# EasyEDA schematic SD_Card.json

## Sheets
1 ESP32: TITLE: Sheet_1; REV: 1.0; Date: 2026-05-02; Sheet: 1/1; Drawn By: levonnkarapetyan; Company: Your Company
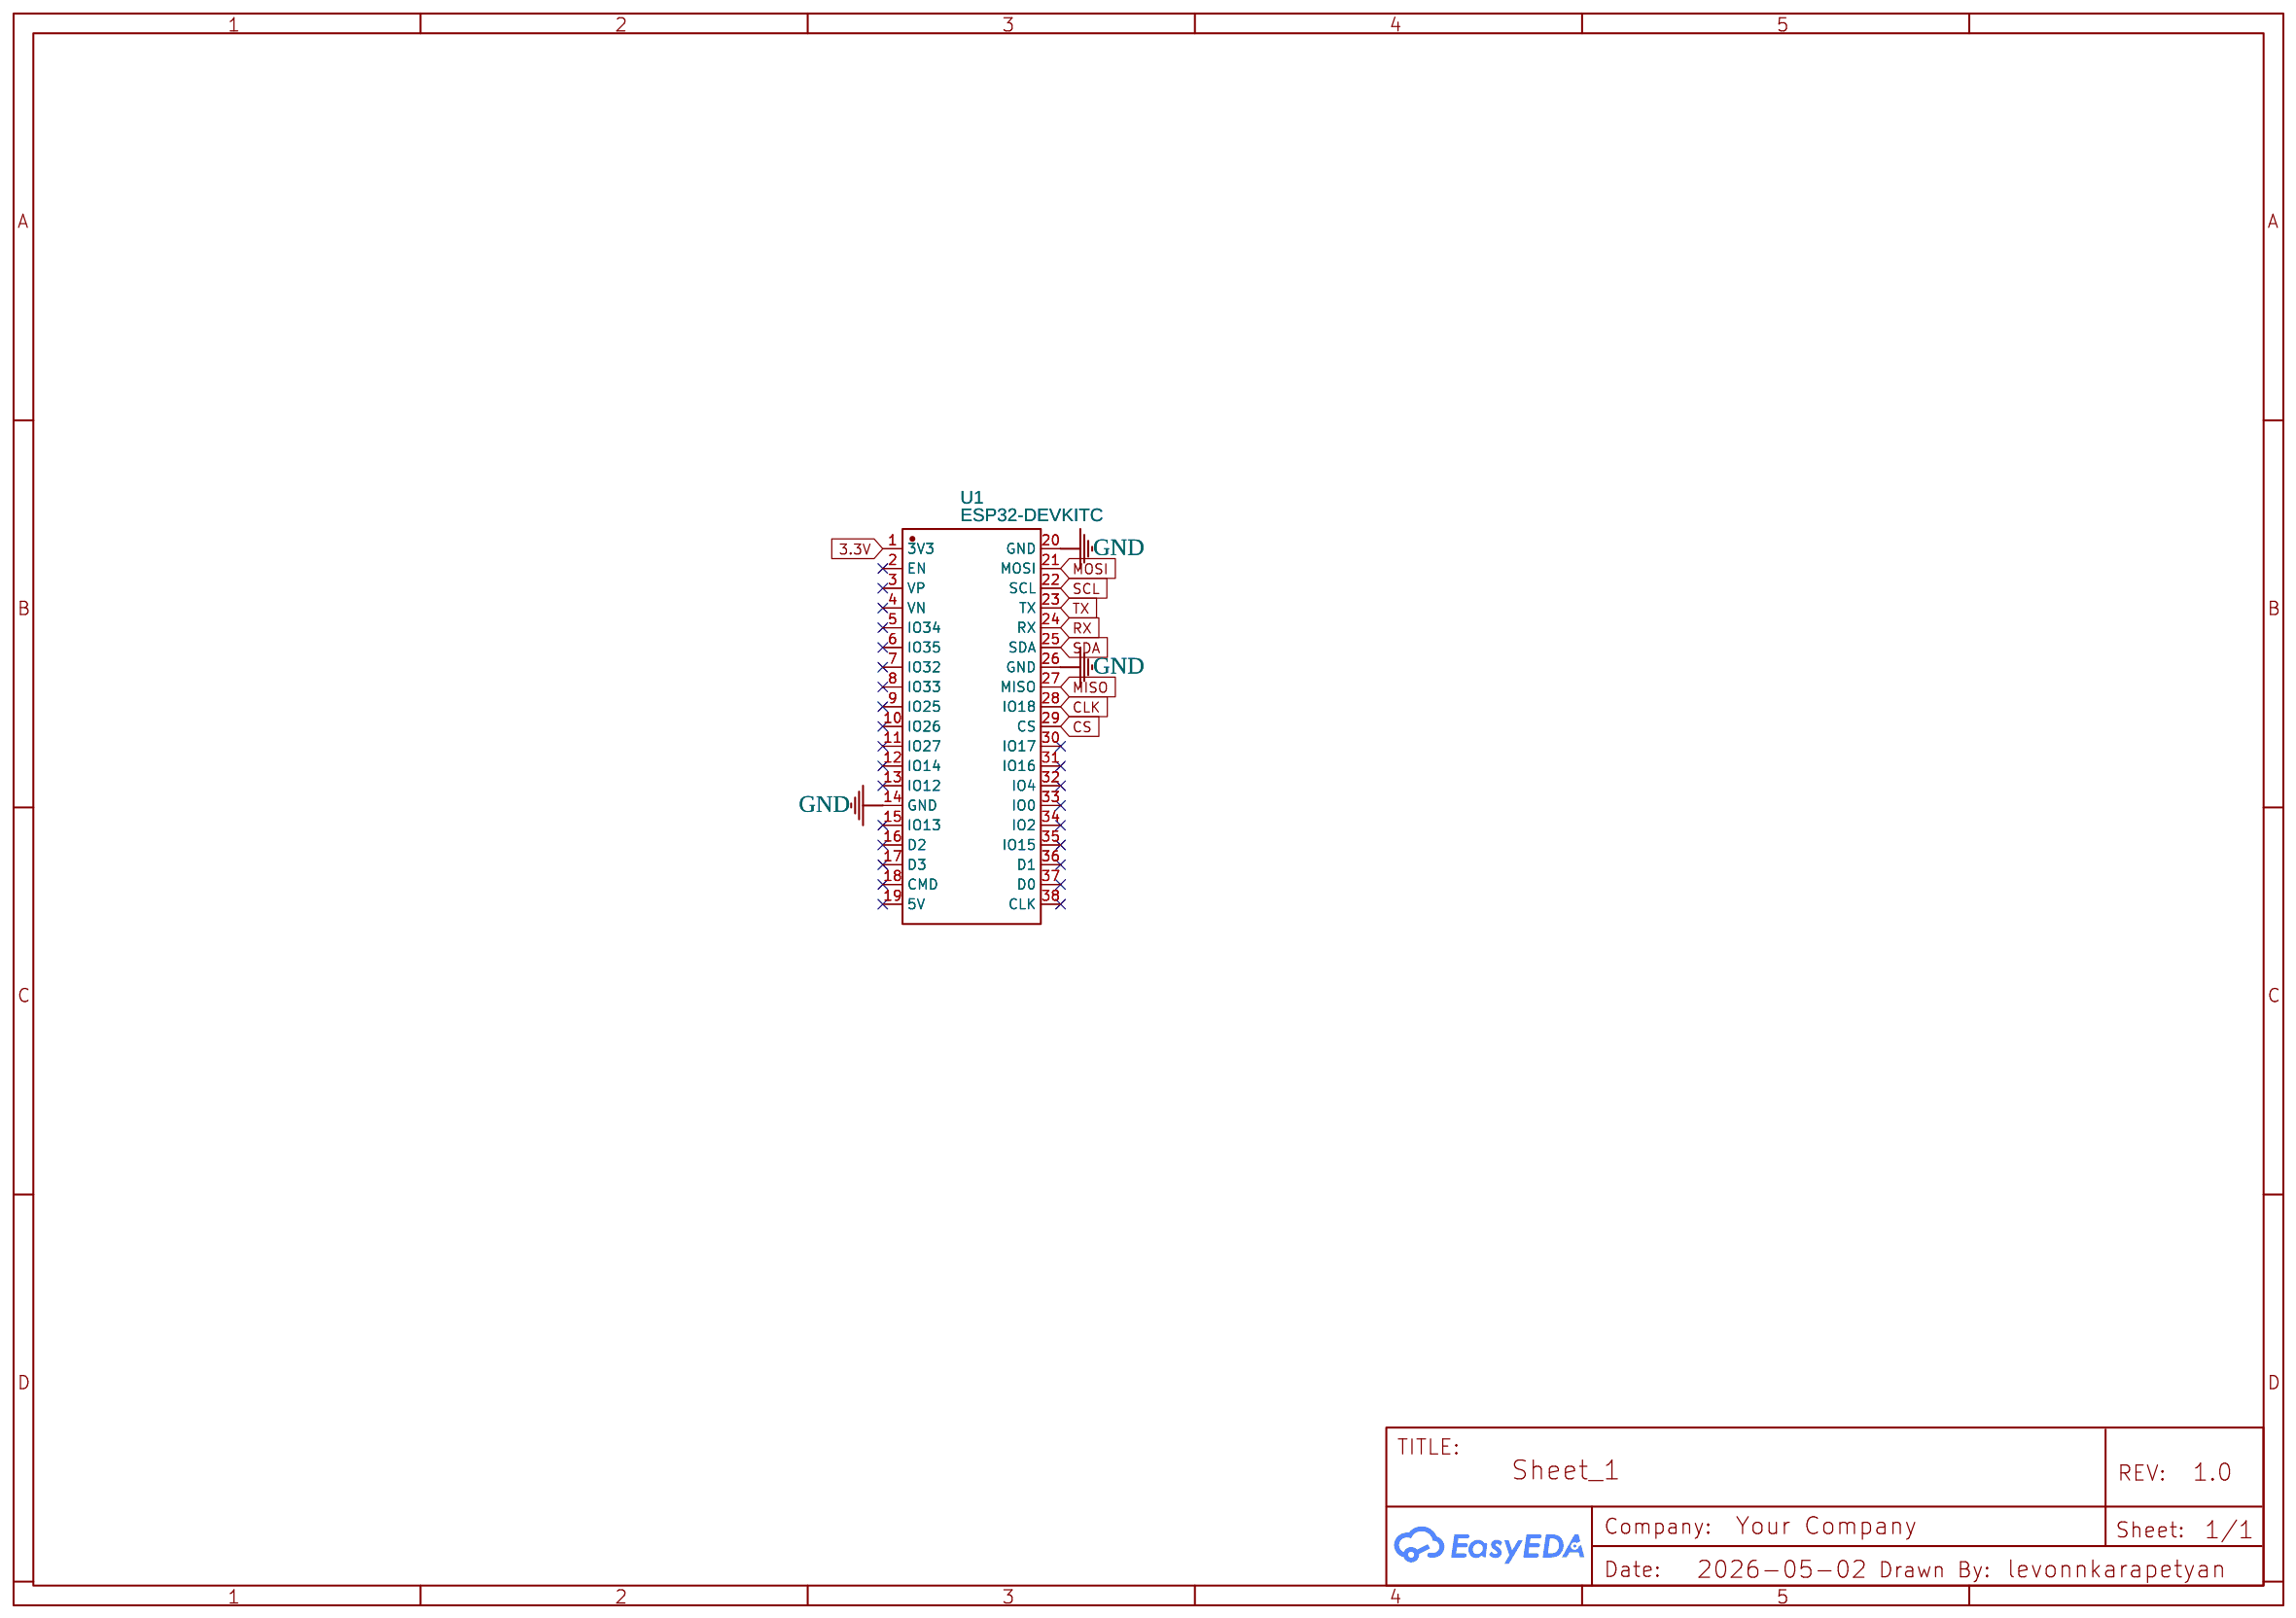
[diagram p0: ESP32]
2 SD_CARD
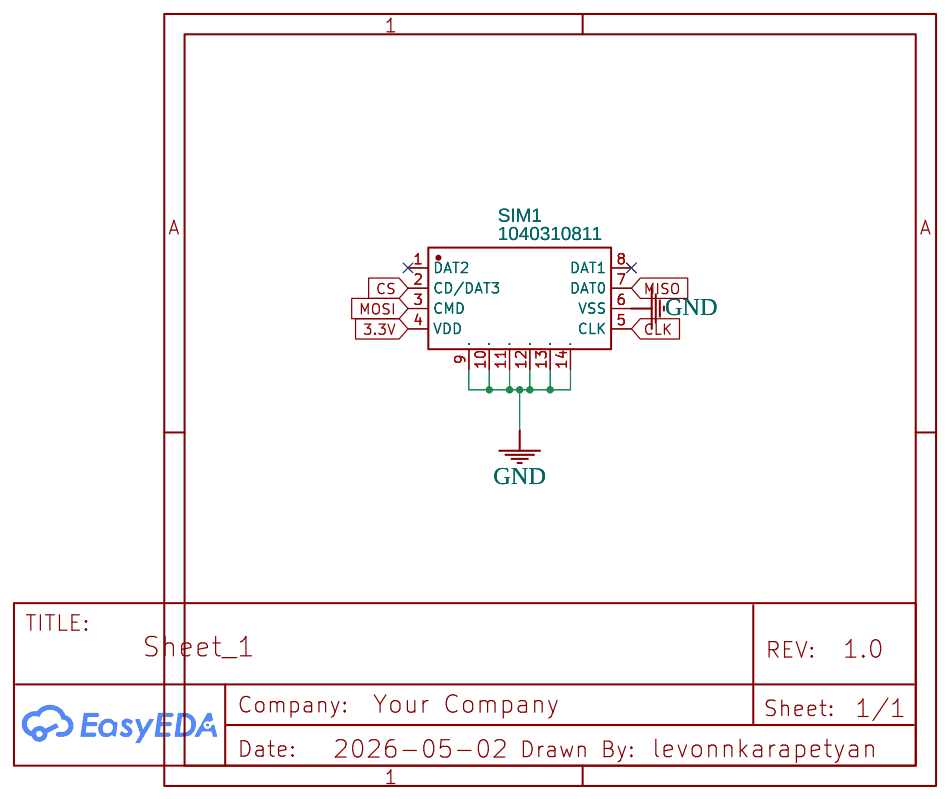
[diagram p1: SD_CARD]
3 CO2_sensor
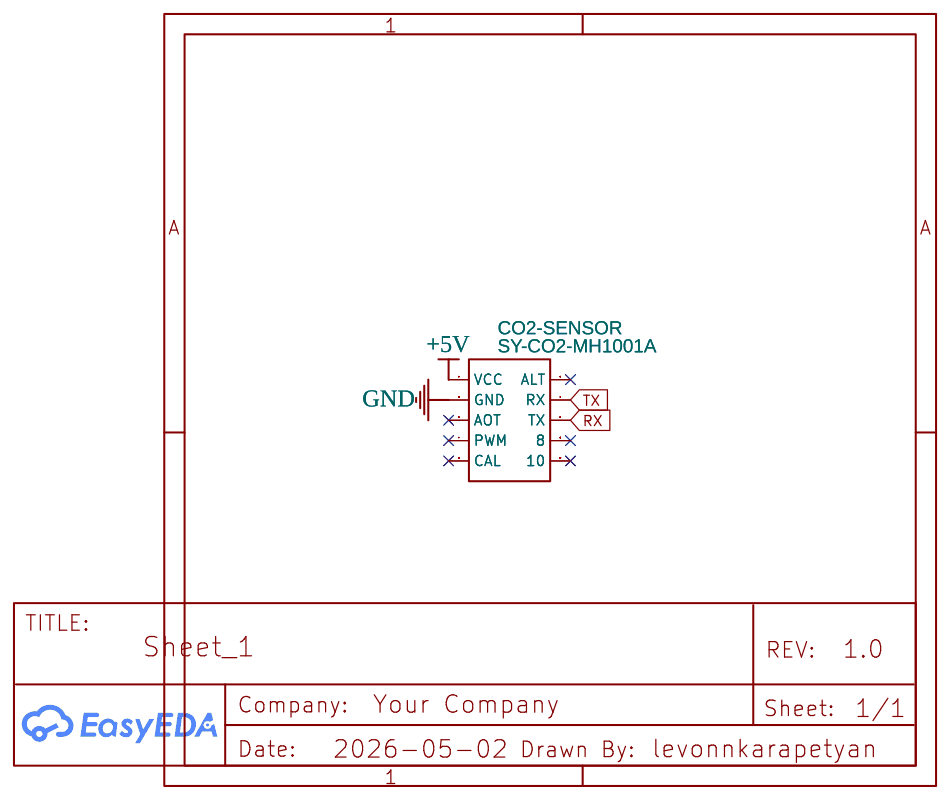
[diagram p2: CO2_sensor]
4 BME280
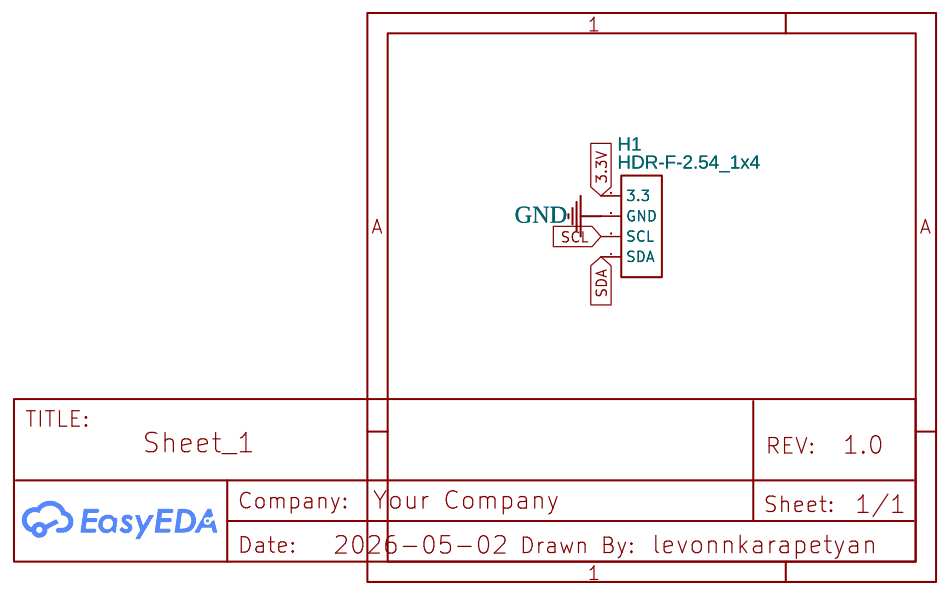
[diagram p3: BME280]
5 PMS5003
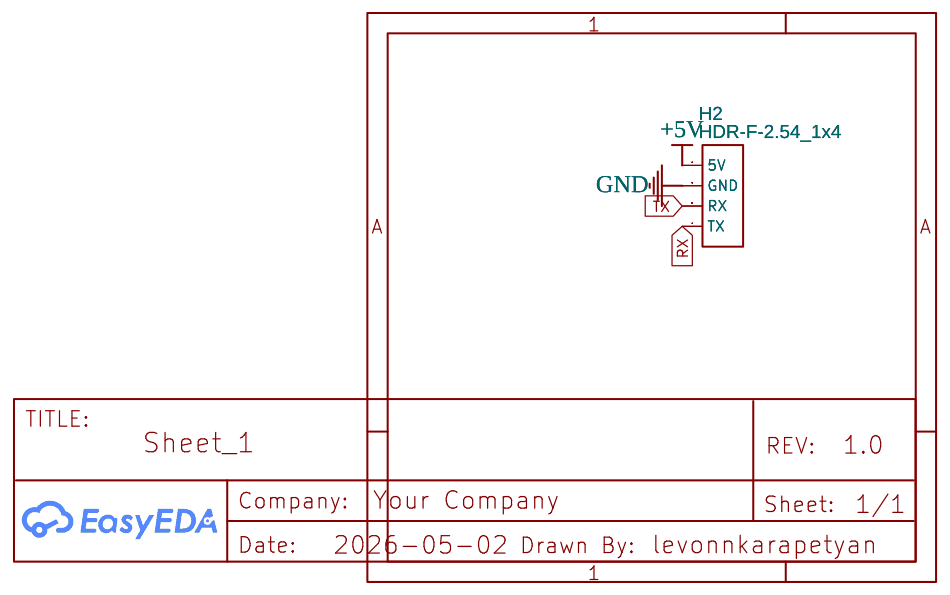
[diagram p4: PMS5003]
6 Booster
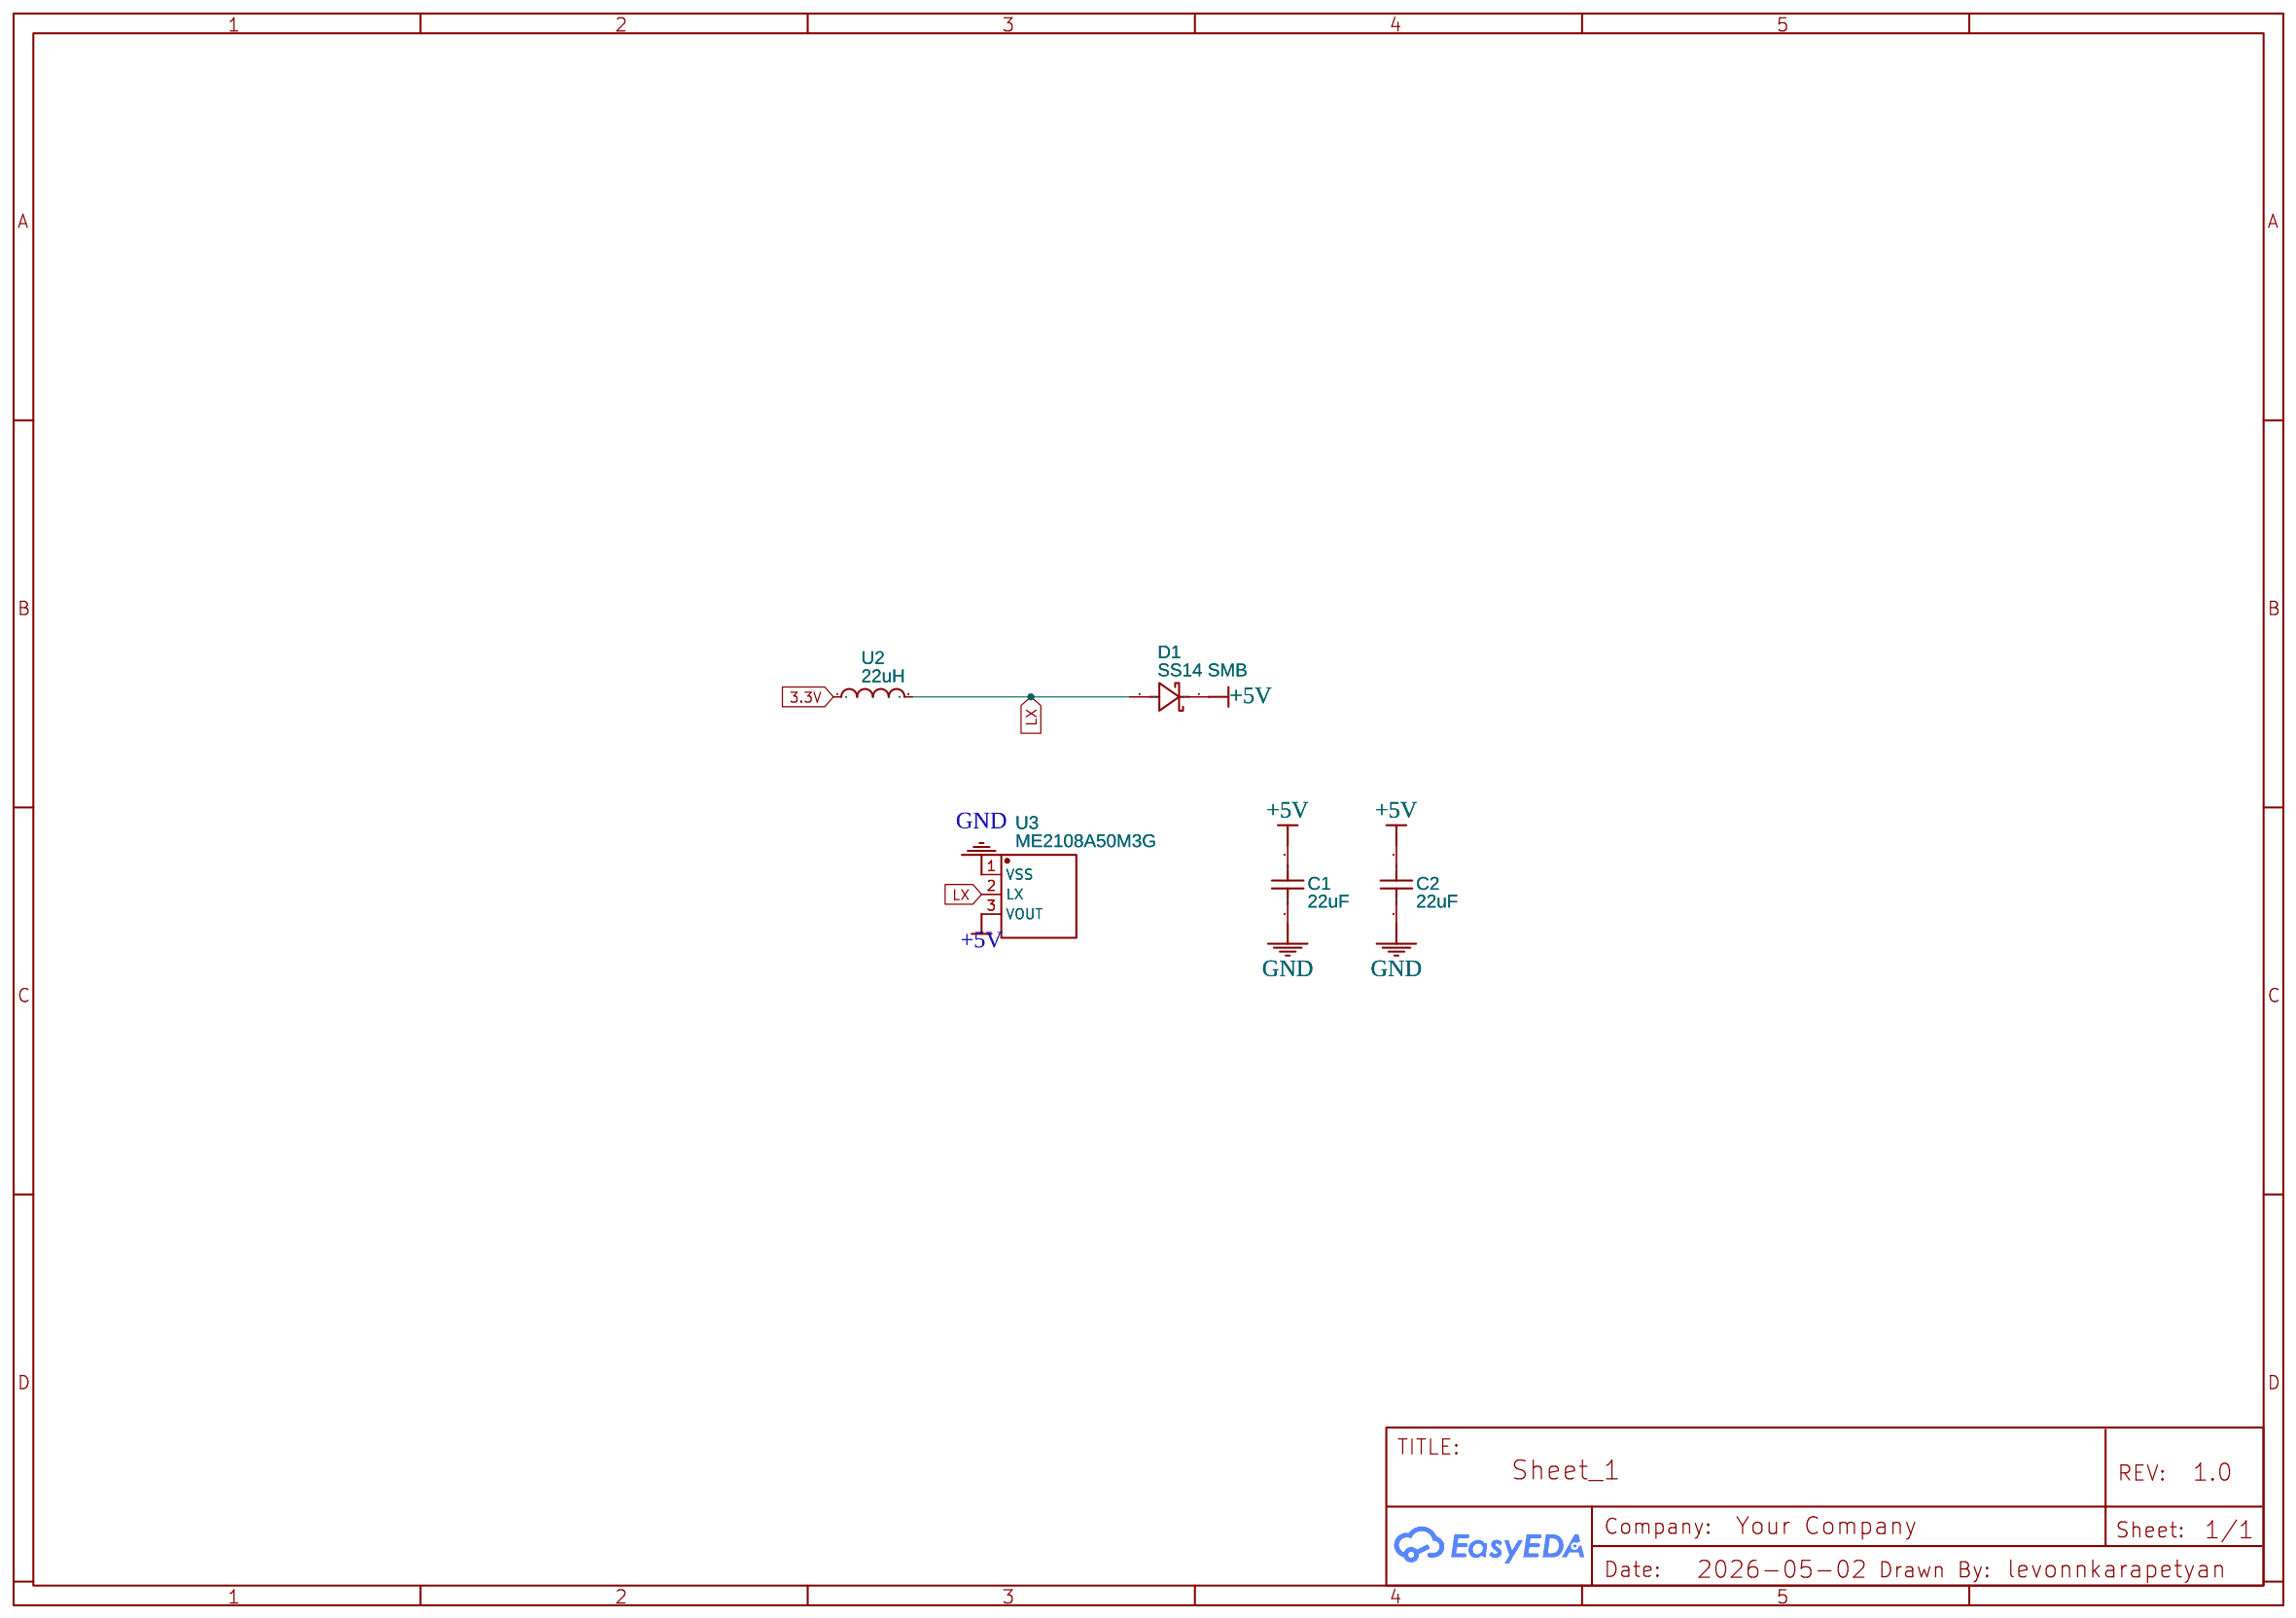
[diagram p5: Booster]

## Parts
sheet BME280
H1  HDR-F-2.54_1x4  [HDR-F-2.54_1X4]
sheet Booster
C1  22uF  [C0805]
C2  22uF  [C0805]
D1  SS14 SMB  [DO-214AC_L4.3-W3.6-LS5.3-RD]
U2  22uH  [IND-SMD_L7.1-W6.6]
U3  ME2108A50M3G  [SOT-23-3_L2.9-W1.3-P1.90-LS2.4-BR]
sheet CO2_sensor
CO2-SENSOR  SY-CO2-MH1001A  [HDR-F-2.54_2X5]
sheet ESP32
U1  ESP32-DEVKITC  [BULETM-SMD_ESP32-DEVKITC]
sheet PMS5003
H2  HDR-F-2.54_1x4  [HDR-F-2.54_1X4]
sheet SD_CARD
SIM1  1040310811  [SIM-SMD_8P-1040310811]

## Library data of the parts
H1 H2 = HDR-F-2.54_1x4: Supplier Part: C225501; Supplier: LCSC; Contributor: LCEDA_Lib
C1 C2 = CL21A226MAYNNNE: Contributor: LCSC; Supplier: LCSC; Supplier Part: C602037; Manufacturer: SAMSUNG(三星); JLCPCB Part Class: Extended Part
D1 = SS14 SMB: Contributor: LCSC; Supplier: LCSC; Supplier Part: C920329; Manufacturer: BORN(伯恩半导体); JLCPCB Part Class: Extended Part
U2 = APH0630T220M: Supplier: LCSC; Supplier Part: C5349702; Manufacturer: APV(爱普微); JLCPCB Part Class: Extended Part; Contributor: lcsc
U3 = ME2108A50M3G: Supplier: LCSC; Manufacturer: MICRONE(南京微盟); Supplier Part: C14839; JLCPCB Part Class: Extended Part
CO2-SENSOR = HDR-F-2.54_2x5: Supplier Part: C30419; Supplier: LCSC; Contributor: LCEDA_Lib
U1 = ESP32-DEVKITC: Supplier: LCSC; Supplier Part: C571180; Manufacturer: ESPRESSIF(乐鑫); Manufacturer Part: ESP32-DevKitC; Contributor: lcsc
SIM1 = 1040310811: Contributor: LCSC; Supplier: LCSC; Supplier Part: C585350; Manufacturer: MOLEX; JLCPCB Part Class: Extended Part

## Nets
3.3V: H1.1(3.3) SIM1.4(VDD) U1.1(3V3) U2.1
+5V: C1.2 C2.2 CO2-SENSOR.1(VCC) D1.1(K) H2.1(5V) U3.3(VOUT)
GND: C1.1 C2.1 CO2-SENSOR.3(GND) H1.2(GND) H2.2(GND) SIM1.6(VSS) SIM1.9 SIM1.10 SIM1.11 SIM1.12 SIM1.13 SIM1.14 U1.14(GND) U1.20(GND) U1.26(GND) U3.1(VSS)
CLK: SIM1.5(CLK) U1.28(IO18)
CS: SIM1.2(CD/DAT3) U1.29(CS)
LX: D1.2(A) U2.2 U3.2(LX)
MISO: SIM1.7(DAT0) U1.27(MISO)
MOSI: SIM1.3(CMD) U1.21(MOSI)
RX: CO2-SENSOR.6(TX) H2.4(TX) U1.24(RX)
SCL: H1.3(SCL) U1.22(SCL)
SDA: H1.4(SDA) U1.25(SDA)
TX: CO2-SENSOR.4(RX) H2.3(RX) U1.23(TX)

Not connected (* = marked no-connect by the designer): CO2-SENSOR 2(ALT)* 5(AOT)* 7(PWM)* 8* 9(CAL)* 10*; SIM1 1(DAT2)* 8(DAT1)*; U1 2(EN)* 3(VP)* 4(VN)* 5(IO34)* 6(IO35)* 7(IO32)* 8(IO33)* 9(IO25)* 10(IO26)* 11(IO27)* 12(IO14)* 13(IO12)* 15(IO13)* 16(D2)* 17(D3)* 18(CMD)* 19(5V)* 30(IO17)* 31(IO16)* 32(IO4)* 33(IO0)* 34(IO2)* 35(IO15)* 36(D1)* 37(D0)* 38(CLK)*
